# EAGLE design emonDCduo-ESP v0.4 (EAGLE 7.7.0)
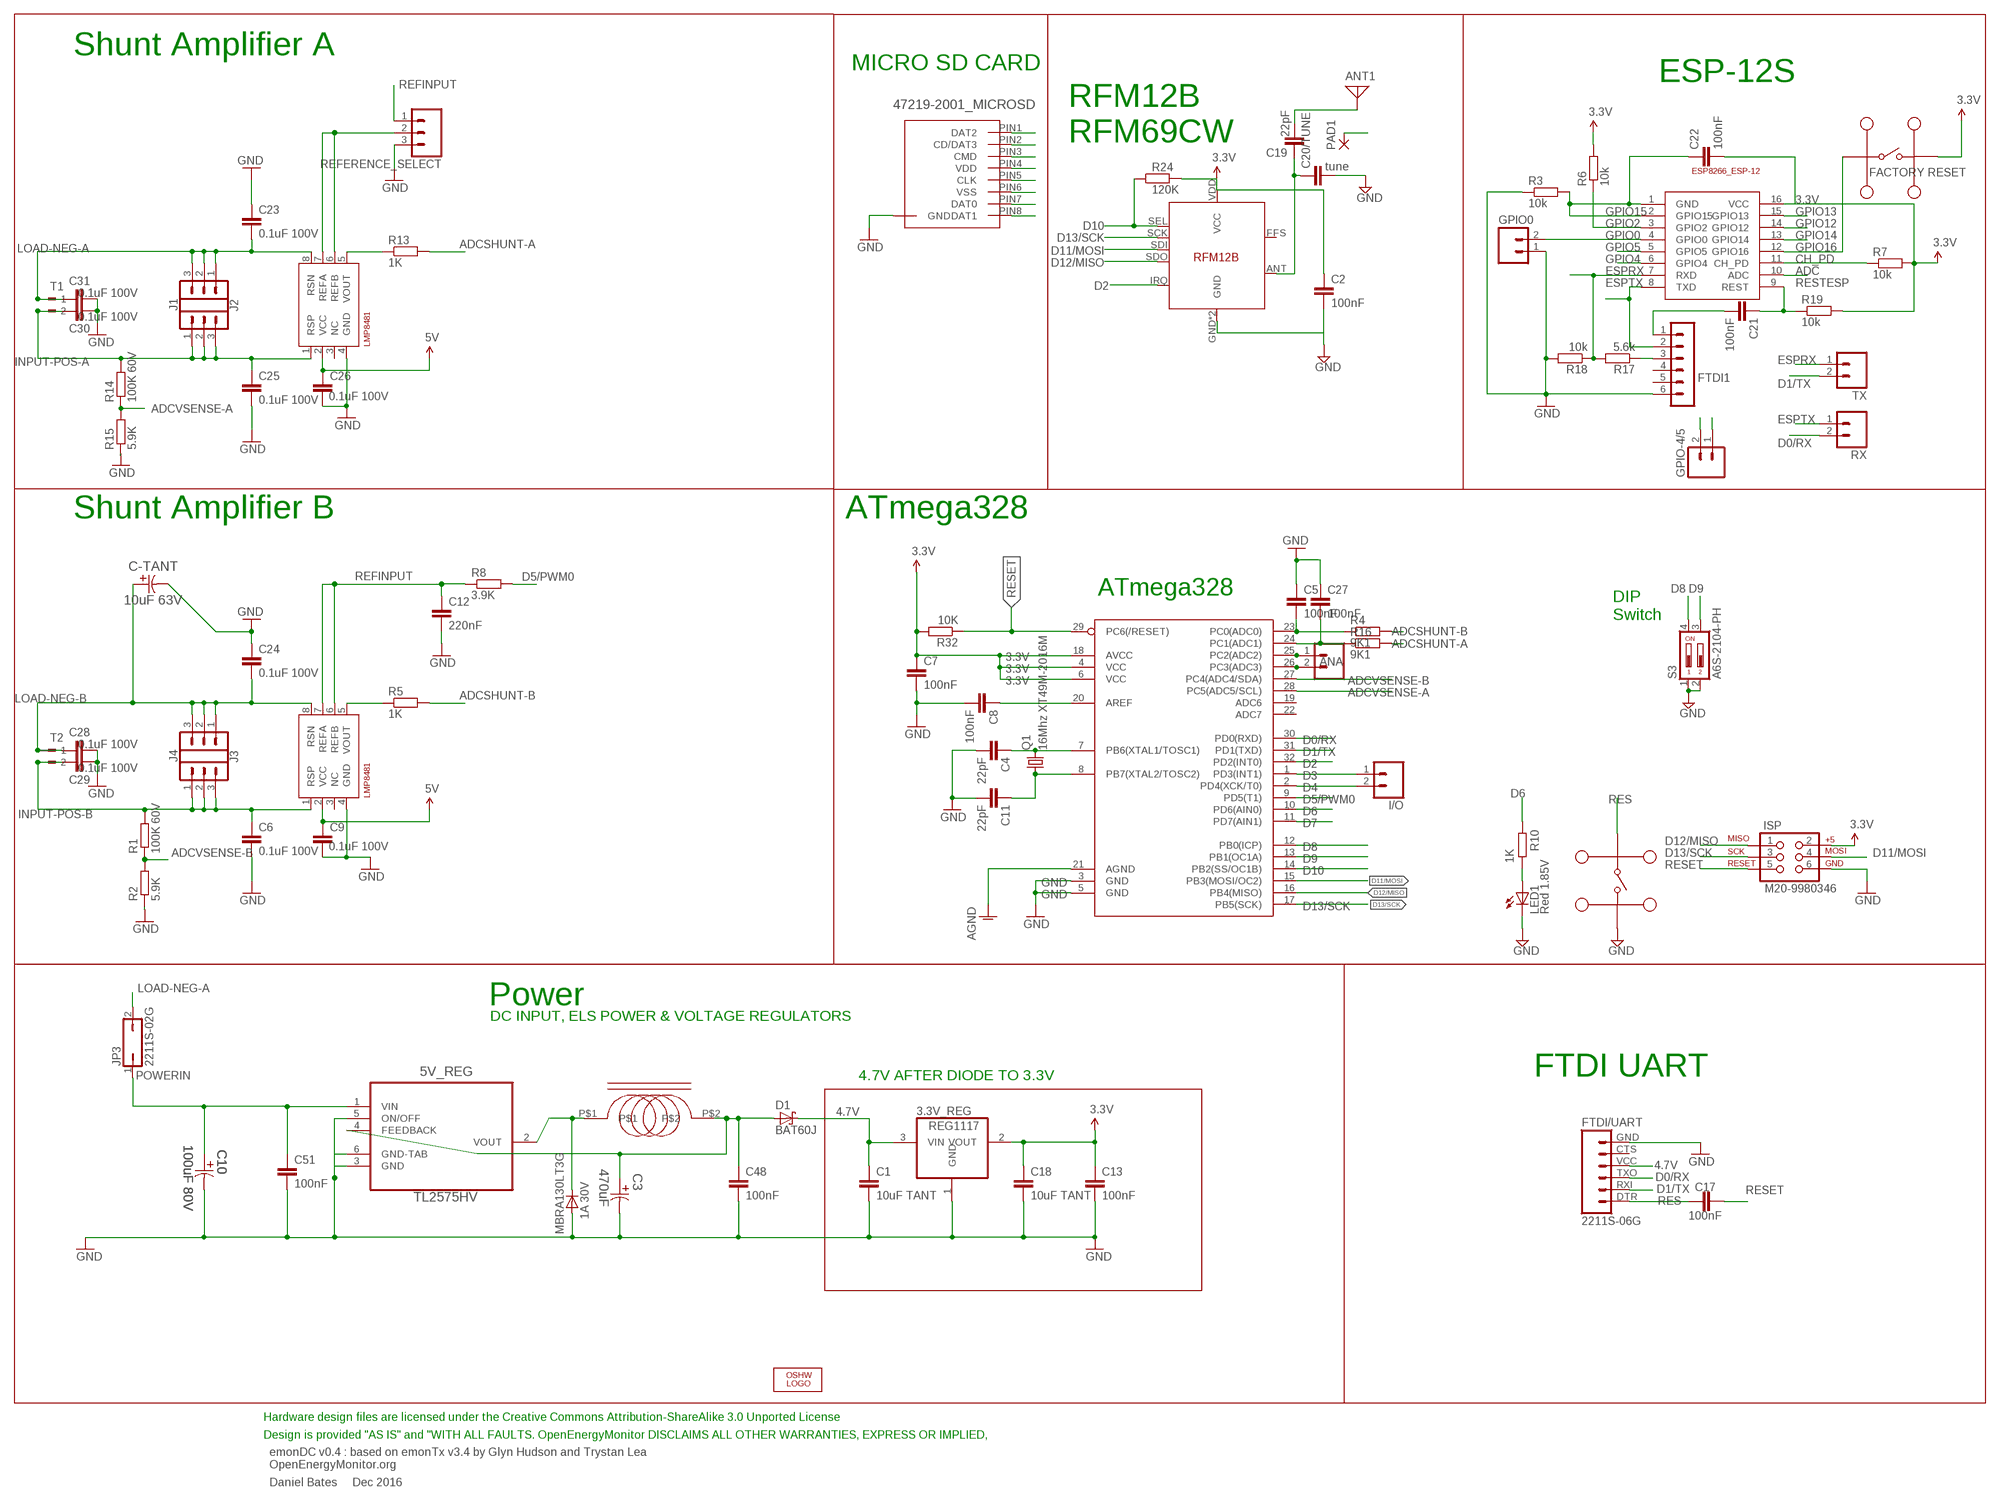
[diagram p0: schematic, sheet 1]

## Parts
3.3V_REG  REG1117  [SOT223]
5V_REG  TL2575HV  TL2575HV-05IKTTR  [TO-263]
ANA  2212S-02SG-85  M02LOCK  [1X02_LOCK]
ANT1  ANTENNA  [PAD-01]
C1  10uF TANT  C-EUC0603  [C0603]
C2  100nF  C-EUC0603  [C0603]
C3  470uF  EEE-FK1C471P-CASE-F  [CAPAE830X1050N]
C4  22pF  C-EUC0603  [C0603]
C5  100nF  C-EUC0603  [C0603]
C6  0.1uF 100V  C-EUC0603  [C0603]
C7  100nF  C-EUC0603  [C0603]
C8  100nF  C-EUC0603  [C0603]
C9  0.1uF 100V  C-EUC0603  [C0603]
C10  100uF 80V  EEV-FK1K101Q-CASE-H13  [CAPAE1350X1400N]
C11  22pF  C-EUC0603  [C0603]
C12  220nF  C-EUC0603  [C0603]
C13  100nF  C-EUC0603  [C0603]
C17  100nF  C-EUC0603  [C0603]
C18  10uF TANT  C-EUC0603  [C0603]
C19  22pF  C-EUC0603  [C0603]
C20/TUNE  tune  C-EUC0603  [C0603]
C21  100nF  C-EUC0603  [C0603]
C22  100nF  C-EUC0603  [C0603]
C23  0.1uF 100V  C-EUC0603  [C0603]
C24  0.1uF 100V  C-EUC0603  [C0603]
C25  0.1uF 100V  C-EUC0603  [C0603]
C26  0.1uF 100V  C-EUC0603  [C0603]
C27  100nF  C-EUC0603  [C0603]
C28  0.1uF 100V  C-EUC0603  [C0603]
C29  0.1uF 100V  C-EUC0603  [C0603]
C30  0.1uF 100V  C-EUC0603  [C0603]
C31  0.1uF 100V  C-EUC0603  [C0603]
C48  100nF  C-EUC0603  [C0603]
C51  100nF  C-EUC0603  [C0603]
C-TANT  10uF 63V  293D  [2917]
D1  BAT60J  [SOD323_ST]
D2  MBRA130LT3G  [DO-214]
ESP-12  ESP8266_ESP-12  [ESP8266-ESP12]
FTDI1  FTDI-ESP  MA06-1  [MA06-1]
FTDI/UART  2211S-06G  FTDI_BASICPTH  [FTDI_BASIC]
GPIO0  M02PTH  [1X02]
GPIO-4/5  M02PTH  [1X02]
I1  SRR0603-331KL  [SRR0603-331KL]
I/O  2212S-02SG-85  M02LOCK  [1X02_LOCK]
ISP  M20-9980346  AVR_SPI_PRG_6PTH  [2X3]
J1  CONN_03  [1X03]
J2  CONN_03  [1X03]
J3  CONN_03  [1X03]
J4  CONN_03  [1X03]
JP3  2211S-02G  JP1Q  [JP1]
LED1  Red 1.85V  LEDCHIP-LED0805  [CHIP-LED0805]
LOGO1  OSHW_LOGO_6MILX0200-NT  [OSHW_6X200_NOTEXT]
MC1  MC32882  [SWITCH_TACT_MULTICOMP]
MC32882  MC32882  [SWITCH_TACT_MULTICOMP]
PAD1  SMD2  [SMD1,27-2,54]
Q1  16Mhz XT49M-2016M  CRYSTALHC49UP  [HC49UP]
R1  100K 60V  R-EU_R0603  [R0603]
R2  5.9K  R-EU_R0603  [R0603]
R3  10k  R-EU_R0603  [R0603]
R4  9K1  R-EU_R0603  [R0603]
R5  1K  R-EU_R0603  [R0603]
R6  10k  R-EU_R0603  [R0603]
R7  10k  R-EU_R0603  [R0603]
R8  3.9K  R-EU_R0603  [R0603]
R10  1K  R-EU_R0603  [R0603]
R13  1K  R-EU_R0603  [R0603]
R14  100K 60V  R-EU_R0603  [R0603]
R15  5.9K  R-EU_R0603  [R0603]
R16  9K1  R-EU_R0603  [R0603]
R17  5.6k  R-EU_R0603  [R0603]
R18  10k  R-EU_R0603  [R0603]
R19  10k  R-EU_R0603  [R0603]
R24  120K  R-EU_R0603  [R0603]
R32  10K  R-EU_R0603  [R0603]
REFERENCE_SELECT  2212S-02SG-85  CONN_03  [1X03]
RF  RFM12B  [RFM12B]
RX  M02PTH  [1X02]
S3  A6S-2104-PH  2_SMT_DIP_SWITCH  [DIP_SWITCH_SMT]
SHUNTMON-A  LMP8481  LMP8481LMP8481-H  [S-PDSO-G08]
SHUNTMON-B  LMP8481  LMP8481LMP8481-H  [S-PDSO-G08]
T1  180-2  [180-2]
T2  180-2  [180-2]
TX  M02PTH  [1X02]
U1_TQFP  ATMEGA328P  ATMEGA328_SMT  [TQFP32-08]
U$1  47219-2001_MICROSD  [47219-2001_MICROSD]

## Nets
3.3V: 3.3V_REG.2(VOUT) C2.1 C7.1 C13.1 C18.1 C22.2 ESP-12.16(VCC) ISP.2 MC1.P$3 MC1.P$4 R6.2 R7.2 R19.2 R24.2 R32.2 RF.VDD(VCC) U1_TQFP.4(VCC) U1_TQFP.6(VCC) U1_TQFP.18(AVCC) U$1.PIN4(VDD)
4.7V [power]: 3.3V_REG.3(VIN) C1.1 C9.1 C26.1 D1.C FTDI/UART.VCC SHUNTMON-A.2(VCC) SHUNTMON-B.2(VCC) ; supply symbol labelled 5V
5.0V [power]: 5V_REG.4(FEEDBACK) C3.1 C48.1 D1.A I1.P$2
ADC: ESP-12.10(ADC)
ADC2: ANA.1 U1_TQFP.25(PC2(ADC2))
ADC3: ANA.2 U1_TQFP.26(PC3(ADC3))
ADCSHUNT-A: R13.2 R16.2
ADCSHUNT-B: R4.2 R5.2
ADCVSENSE-A: R14.1 R15.2 U1_TQFP.28(PC5(ADC5/SCL))
ADCVSENSE-B: R1.1 R2.2 U1_TQFP.27(PC4(ADC4/SDA))
AGND [thin_power]: U1_TQFP.21(AGND)
CH_PD: ESP-12.11(CH_PD) R7.1
D0/RX: FTDI/UART.TXO RX.2 U1_TQFP.30(PD0(RXD))
D1/TX: FTDI/UART.RXI TX.2 U1_TQFP.31(PD1(TXD))
D2: RF.IRQ U1_TQFP.32(PD2(INT0))
D3: I/O.1 U1_TQFP.1(PD3(INT1))
D4: I/O.2 U1_TQFP.2(PD4(XCK/T0))
D5/PWM0: R8.2 U1_TQFP.9(PD5(T1))
D6: R10.2 U1_TQFP.10(PD6(AIN0))
D7: U1_TQFP.11(PD7(AIN1))
D8: S3.4 U1_TQFP.12(PB0(ICP))
D9: S3.3 U1_TQFP.13(PB1(OC1A))
D10: R24.1 RF.SEL U1_TQFP.14(PB2(SS/OC1B))
D11/MOSI: ISP.4 RF.SDI U1_TQFP.15(PB3(MOSI/OC2))
D12/MISO: ISP.1 RF.SDO U1_TQFP.16(PB4(MISO))
D13/SCK: ISP.3 RF.SCK U1_TQFP.17(PB5(SCK))
DIG1: C19.1 C20/TUNE.1 RF.ANT
ESPRX: ESP-12.7(RXD) R17.2 R18.1 TX.1
ESPTX: ESP-12.8(TXD) FTDI1.2 RX.1
GND [thin_power]: 3.3V_REG.1(GND) 5V_REG.3(GND) 5V_REG.5(ON/OFF) 5V_REG.6(GND-TAB) C1.2 C2.2 C3.2 C4.2 C5.1 C6.2 C7.2 C8.2 C9.2 C10.2 C11.2 C12.2 C13.2 C18.2 C20/TUNE.2 C23.1 C24.1 C25.2 C26.2 C27.1 C28.2 C29.2 C30.2 C31.2 C48.2 C51.2 C-TANT.2 D2.P$2(A) FTDI1.6 FTDI/UART.GND GPIO0.1 ISP.6 LED1.C MC32882.P$3 MC32882.P$4 R2.1 R3.1 R15.1 R18.2 REFERENCE_SELECT.3 RF.GND RF.P$12(GND) S3.1 S3.2 SHUNTMON-A.4(GND) SHUNTMON-B.4(GND) U1_TQFP.3(GND) U1_TQFP.5(GND) U$1.P$1(GND) U$1.P$2(GND) U$1.P$3(GND) U$1.P$4(GND) U$1.PIN6(VSS)
GPIO0: ESP-12.4(GPIO0) GPIO0.2
GPIO2: ESP-12.3(GPIO2) R6.1 U$1.PIN2(CD/DAT3)
GPIO4: ESP-12.6(GPIO4) GPIO-4/5.1
GPIO5: ESP-12.5(GPIO5) GPIO-4/5.2
GPIO12: ESP-12.14(GPIO12) U$1.PIN7(DAT0)
GPIO13: ESP-12.15(GPIO13) U$1.PIN3(CMD)
GPIO14: ESP-12.13(GPIO14) U$1.PIN5(CLK)
GPIO15: C22.1 ESP-12.1(GND) ESP-12.2(GPIO15) R3.2
GPIO16: ESP-12.12(GPIO16) MC1.P$1 MC1.P$2
IND: 5V_REG.2(VOUT) D2.P$1(C) I1.P$1
INPUT-POS-A: C25.1 C30.1 J2.1 J2.2 J2.3 R14.2 SHUNTMON-A.1(RSP) T1.2
INPUT-POS-B: C6.1 C29.1 J3.1 J3.2 J3.3 R1.2 SHUNTMON-B.1(RSP) T2.2
LOAD-NEG-A: C23.2 C31.1 J1.1 J1.2 J1.3 JP3.2 SHUNTMON-A.8(RSN) T1.1
LOAD-NEG-B: C24.2 C28.1 C-TANT.1 J4.1 J4.2 J4.3 SHUNTMON-B.8(RSN) T2.1
N$1: C4.1 Q1.2 U1_TQFP.7(PB6(XTAL1/TOSC1))
N$2: C5.2 R4.1 U1_TQFP.23(PC0(ADC0))
N$3: ANT1.1 C19.2
N$4: R13.1 SHUNTMON-A.5(VOUT)
N$5: PAD1.1(P)
N$6: R5.1 SHUNTMON-B.5(VOUT)
N$7: U$1.PIN1(DAT2)
N$9: C11.1 Q1.1 U1_TQFP.8(PB7(XTAL2/TOSC2))
N$20: C8.1 U1_TQFP.20(AREF)
N$27: C27.2 R16.1 U1_TQFP.24(PC1(ADC1))
N$28 [thin_power]: REFERENCE_SELECT.2 SHUNTMON-A.6(REFB) SHUNTMON-A.7(REFA)
N$30: C21.2 FTDI1.1
N$32: U$1.PIN8(DAT1)
N$36: FTDI1.3 R17.1
N$41: LED1.A R10.1
POWERIN: 5V_REG.1(VIN) C10.1 C51.1 JP3.1
REFINPUT: C12.1 R8.1 REFERENCE_SELECT.1 SHUNTMON-B.6(REFB) SHUNTMON-B.7(REFA)
RES: C17.1 FTDI/UART.DTR MC32882.P$1 MC32882.P$2
RESET: C17.2 ISP.5 R32.1 U1_TQFP.29(PC6(/RESET))
RESTESP: C21.1 ESP-12.9(REST) R19.1
Unconnected: FTDI1.4 FTDI1.5 FTDI/UART.CTS RF.FFS SHUNTMON-A.3(NC) SHUNTMON-B.3(NC) U1_TQFP.19(ADC6) U1_TQFP.22(ADC7)

## Notes on the sheet
- Shunt Amplifier A
- MICRO SD CARD
- ESP-12S
- RFM12B
  RFM69CW
- FACTORY RESET
- Shunt Amplifier B | ATmega328
- ATmega328
- DIP
  Switch
- Power
- DC INPUT, ELS POWER & VOLTAGE REGULATORS
- 4.7V AFTER DIODE TO 3.3V | FTDI UART
- Hardware design files are licensed under the Creative Commons Attribution-ShareAlike 3.0 Unported License
- Design is provided "AS IS" and "WITH ALL FAULTS. OpenEnergyMonitor DISCLAIMS ALL OTHER WARRANTIES, EXPRESS OR IMPLIED,
- emonDC v0.4 : based on emonTx v3.4 by Glyn Hudson and Trystan Lea
  OpenEnergyMonitor.org
- Daniel Bates     Dec 2016

## Library data of the parts
3.3V_REG = burr-brown:REG1117: 800mA and 1A Low Dropout (LDO) Positive Regulator 1.8V, 2.5V, 2.85V, 3.3V, 5V, and Adj; MF: TEXAS INSTRUMENTS; MPN: REG1117; OC_FARNELL: 1097566; OC_NEWARK: 14P6981
5V_REG = TL2575HV:TL2575HV; MF: TEXAS INSTRUMENTS; MPN: LM2575HVS-15/NOPB; OC_FARNELL: 2492609
ANA I/O = SparkFun-Connectors:M02: Standard 2-pin 0.1" header. Use with - straight break away headers ( PRT-00116) - right angle break away headers (PRT-00553) - swiss pins (PRT-00743) - machine pins (PRT-00117) - female headers (PRT-00115) Molex polarized connector foot print use with: PRT-08233 with associated crimp pins and housings. 2.54_SCREWTERM for use with PRT-10571. 3.5mm Screw Terminal footprints for PRT-08084 5mm Screw Terminal footprints for use with PRT-08432; MF: MULTICOMP; MPN: 2212S-02SG-85; OC_FARNELL: 1593458
ANT1 = discrete:ANTENNA: Antenna; OC_FARNELL: unknown
C1 C2 C4 C5 C7 C8 C11-C13 C17-C19 C20/TUNE C21 C22 C27 C48 C51 = rcl:C-EU: CAPACITOR, European symbol
C3 = Panasonic-EEEFK_EEEFP:EEE-: Aluminum Electrolytic Capacitors,Surface Mount Type; MPN: EEE-FK1C471P; OC_FARNELL: 9695710; OC_NEWARK: 96K9385; PACKAGE: CASE-F; SUPPLIER: PANASONIC; TOLERANCE: ±20 %; VALUE: 470UF; VOLTAGERATING: 16V
C6 C9 C23-C26 C28-C31 = rcl:C-EU: CAPACITOR, European symbol; MPN: C1608X7S2A104K080AB
C10 = Panasonic-EEE-EEV-EEF-ECQ:EEV-: Aluminum Electrolytic Capacitors,Surface Mount Type; MPN: EEVFK1K101Q; OC_FARNELL: 9696113; OC_NEWARK: 96K9484; SUPPLIER: PANASONIC; TOLERANCE: ±20 %; VALUE: 100UF; VOLTAGERATING: 80V
C-TANT = 2917 footprint capacitor:293D; PARTNO: 293D106X0063E2TE3; SIZE: 2917
D1 = diode:BAT60J: Schottky barrier diode Source: www.st.com, BAT60J.pdf
D2 = CASE 403D Diode:MBRA130LT3G: Fast switching diode; MF: ON SEMICONDUCTOR; MPN: MBRA130LT3G; OC_FARNELL: 9555978
ESP-12 = ESP8266-ESP12:ESP8266_ESP-12
FTDI1 = JeeLabs:MA06-1: PIN HEADER
FTDI/UART = SparkFun:FTDI_BASIC: FTDI Basic: 3.3V and 5V; MF: MULTICOMP; MPN: 2211S-06G; OC_FARNELL: 1593415
GPIO0 GPIO-4/5 RX TX = SparkFun:M02: Header 2 Standard 2-pin 0.1" header. Use with straight break away headers (SKU : PRT-00116), right angle break away headers (PRT-00553), swiss pins (PRT-00743), machine pins (PRT-00117), and female headers (PRT-00115). Molex polarized connector foot print use with SKU : PRT-08233 with associated crimp pins and housings.
I1 = SRR0603-331KL:SRR0603-331KL: SRR0603-331KL; INDUCTANCE: 330uH; MF: BOURNS; MPN: SRR0603-331KL; OC_FARNELL: 2333890
ISP = SparkFun:AVR_SPI_PRG_6: AVR ISP 6 Pin This is the reduced ISP connector for AVR programming. Common on Arduino. This footprint will take up less PCB space and can be used with a 10-pin to 6-pin adapter such as SKU: BOB-08508; MF: HARWIN; MPN: M20-9980346; OC_FARNELL: 1022231
J1-J4 = SparkFun-Connectors:CONN_03: Multi connection point. Often used as Generic Header-pin footprint for 0.1 inch spaced/style header connections On any of the 0.1 inch spaced packages, you can populate with these: Break Away Headers - Straight <https://www.sparkfun.com/products/116> (PRT-00116) Break Away Male Headers - Right Angle <https://www.sparkfun.com/products/553> (PRT-00553) Female Headers <https://www.sparkfun.com/products/115> (PRT-00115) Break Away Headers - Machine Pin <https://www.sparkfun.com/products/117> (PRT-00117) Break Away Female Headers - Swiss Machine Pin <https://www.sparkfun.com/products/743> (PRT-00743) Stackable Header - 3 Pin (Female, 0.1") <https://www.sparkfun.com/products/13875> (PRT-13875) For SCREWTERMINALS and SPRING TERMINALS visit here: Screw Terimnals on SparkFun.com <https://www.sparkfun.com/search/results?term=Screw+Terminals> (5mm/3.5mm/2.54mm spacing) This device is also useful as a general connection point to wire up your design to another part of your project. Our various solder wires solder well into these plated through hole pads. Hook-Up Wire - Assortment (Stranded, 22 AWG) <https://www.sparkfun.com/products/11375> (PRT-11375) Hook-Up Wire - Assortment (Solid Core, 22 AWG) <https://www.sparkfun.com/products/11367> (PRT-11367) View the entire wire category on our website here <https://www.sparkfun.com/categories/141> Special notes: Molex polarized connector foot print use with SKU : PRT-08232 with associated crimp pins and housings.
JP3 = jumper:JP1Q: JUMPER; MF: MULTICOMP; MPN: 2211S-02G; OC_FARNELL: 1593411
LED1 = adafruit:LED: LED OSRAM: - CHIPLED LG R971, LG N971, LY N971, LG Q971, LY Q971, LO R971, LY R971 LH N974, LH R974 LS Q976, LO Q976, LY Q976 LO Q996 - Hyper CHIPLED LW Q18S LB Q993, LB Q99A, LB R99A - SideLED LS A670, LO A670, LY A670, LG A670, LP A670 LB A673, LV A673, LT A673, LW A673 LH A674 LY A675 LS A676, LA A676, LO A676, LY A676, LW A676 LS A679, LY A679, LG A679 - Hyper Micro SIDELED® LS Y876, LA Y876, LO Y876, LY Y876 LT Y87S - SmartLED LW L88C, LW L88S LB L89C, LB L89S, LG L890 LS L89K, LO L89K, LY L89K LS L896, LA L896, LO L896, LY L896 - TOPLED LS T670, LO T670, LY T670, LG T670, LP T670 LSG T670, LSP T670, LSY T670, LOP T670, LYG T670 LG T671, LOG T671, LSG T671 LB T673, LV T673, LT T673, LW T673 LH T674 LS T676, LA T676, LO T676, LY T676, LB T676, LH T676, LSB T676, LW T676 LB T67C, LV T67C, LT T67C, LS T67K, LO T67K, LY T67K, LW E67C LS E67B, LA E67B, LO E67B, LY E67B, LB E67C, LV E67C, LT E67C LW T67C LS T679, LY T679, LG T679 LS T770, LO T770, LY T770, LG T770, LP T770 LB T773, LV T773, LT T773, LW T773 LH T774 LS E675, LA E675, LY E675, LS T675 LS T776, LA T776, LO T776, LY T776, LB T776 LHGB T686 LT T68C, LB T68C - Hyper Mini TOPLED® LB M676 - Mini TOPLED Santana® LG M470 LS M47K, LO M47K, LY M47K Source: http://www.osram.convergy.de/; MF: ROHM; MPN: SML-211UTT86K; OC_FARNELL: 1685056
LOGO1 = ohw-logo:OSHW_LOGO_6MIL; OC_FARNELL: unknown
MC1 MC32882 = multicomp tact switch:MC32882
PAD1 = wirepad:SMD2: SMD PAD
Q1 = adafruit:CRYSTAL: CRYSTAL; MF: VISHAY; MPN: XT49M-2016M; OC_FARNELL: 1469641; OC_NEWARK: unknown
R1 R14 = rcl:R-EU_: RESISTOR, European symbol; MPN: MCWR06X1003FTL
R2 R15 = rcl:R-EU_: RESISTOR, European symbol; MPN: MCWR06X5901FTL
R3-R8 R10 R13 R16-R19 R24 R32 = rcl:R-EU_: RESISTOR, European symbol
REFERENCE_SELECT = SparkFun-Connectors:CONN_03: Multi connection point. Often used as Generic Header-pin footprint for 0.1 inch spaced/style header connections On any of the 0.1 inch spaced packages, you can populate with these: Break Away Headers - Straight <https://www.sparkfun.com/products/116> (PRT-00116) Break Away Male Headers - Right Angle <https://www.sparkfun.com/products/553> (PRT-00553) Female Headers <https://www.sparkfun.com/products/115> (PRT-00115) Break Away Headers - Machine Pin <https://www.sparkfun.com/products/117> (PRT-00117) Break Away Female Headers - Swiss Machine Pin <https://www.sparkfun.com/products/743> (PRT-00743) Stackable Header - 3 Pin (Female, 0.1") <https://www.sparkfun.com/products/13875> (PRT-13875) For SCREWTERMINALS and SPRING TERMINALS visit here: Screw Terimnals on SparkFun.com <https://www.sparkfun.com/search/results?term=Screw+Terminals> (5mm/3.5mm/2.54mm spacing) This device is also useful as a general connection point to wire up your design to another part of your project. Our various solder wires solder well into these plated through hole pads. Hook-Up Wire - Assortment (Stranded, 22 AWG) <https://www.sparkfun.com/products/11375> (PRT-11375) Hook-Up Wire - Assortment (Solid Core, 22 AWG) <https://www.sparkfun.com/products/11367> (PRT-11367) View the entire wire category on our website here <https://www.sparkfun.com/categories/141> Special notes: Molex polarized connector foot print use with SKU : PRT-08232 with associated crimp pins and housings.; MF: MULTICOMP; MPN: 2212S-02SG-85; OC_FARNELL: 1593458
RF = JeeParts:RFM12B; OC_FARNELL: unknown
S3 = OpenEnergyMonitor:2_SMT_DIP_SWITCH: Multicomp MCEMR-02-T 2 throw SMT DIP switch, Farnell 1524005; MF: OMRON ELECTRONIC COMPONENTS; MPN: A6S2104H; OC_FARNELL: 1960894
SHUNTMON-A = lmp8481b:LMP8481: LMP8481MM-H/NOPB 100V/V; MF: TEXAS INSTRUMENTS; MPN: LMP8481MME-S/NOPB; OC_FARNELL: 2322044
SHUNTMON-B = lmp8481b:LMP8481: LMP8481MM-H/NOPB 100V/V; MF: TEXAS INSTRUMENTS; MPN: LMP8481MME-H/NOPB; OC_FARNELL: 2322044
T1 T2 = con-weidmueller-sl35:180-2: WEIDMUELLER CLAMP CONNECTOR; OC_FARNELL: unknown; OC_NEWARK: unknown
U1_TQFP = SparkFun-DigitalIC:ATMEGA328_SMT: 32-Pin Atmega328 part Commonly used on Arduino compatible boards Available in QFP and QFN packages TQFP is IC-09069 QFN is non-stock; MF: ATMEL; MPN: ATMEGA328P-AU; OC_FARNELL: 1972086; PROD_ID: IC-09069
U$1 = 47219-2001_SD_MICRO:47219-2001_MICROSD

## Net classes
2 thin_power: width 0.254 mm

## Board
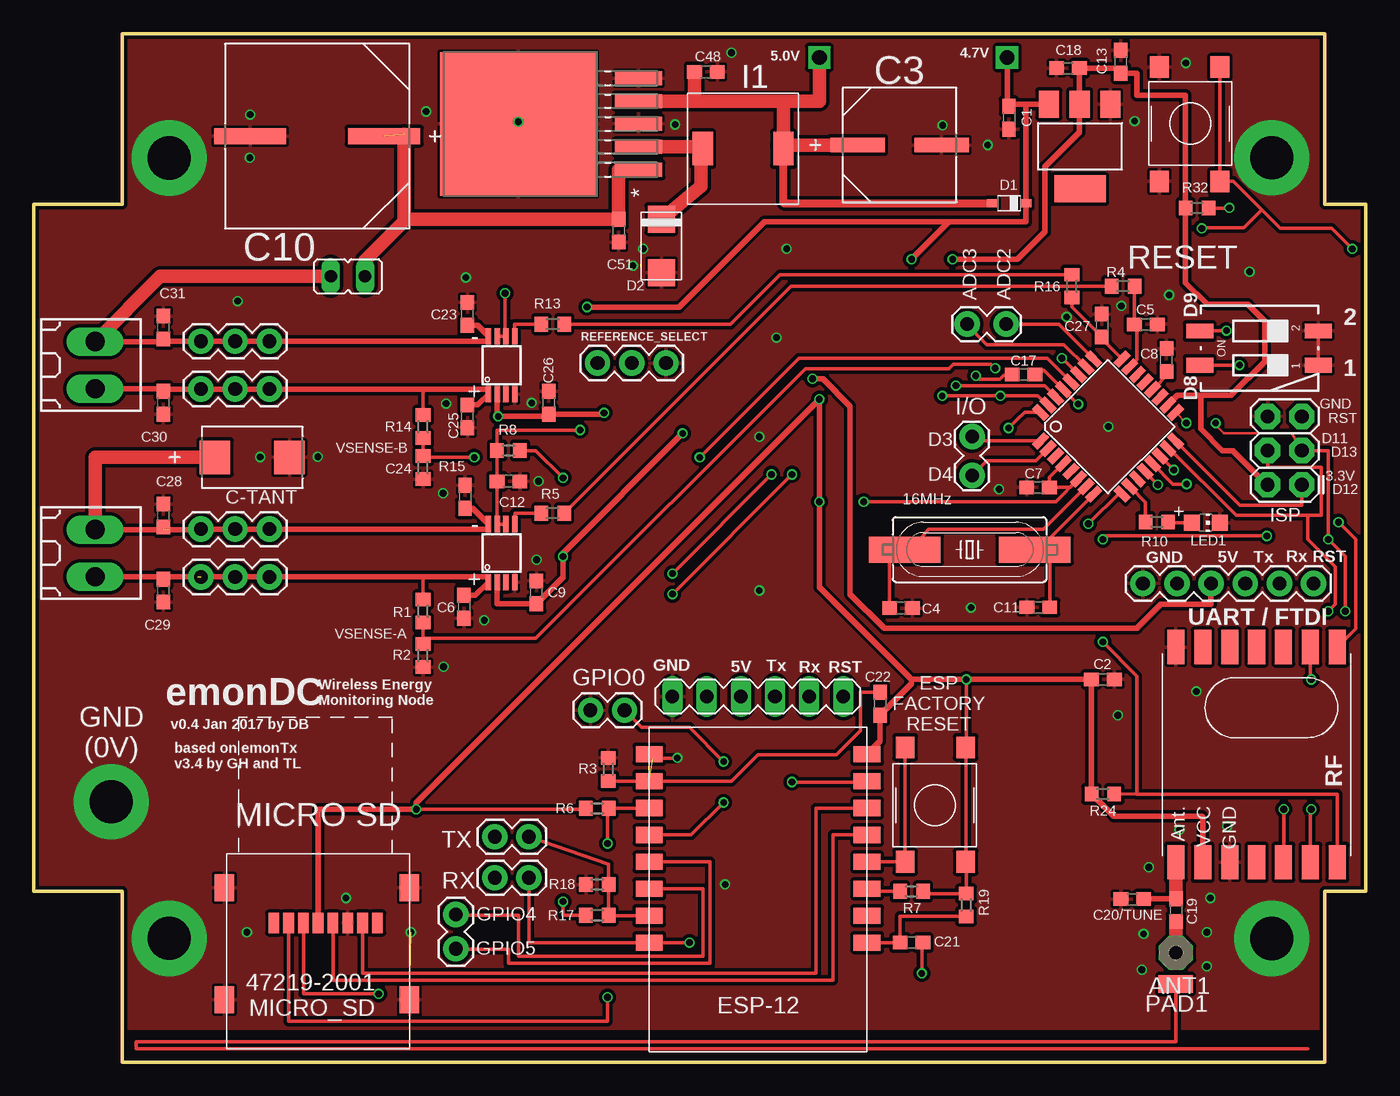
[diagram p1: board, top side]
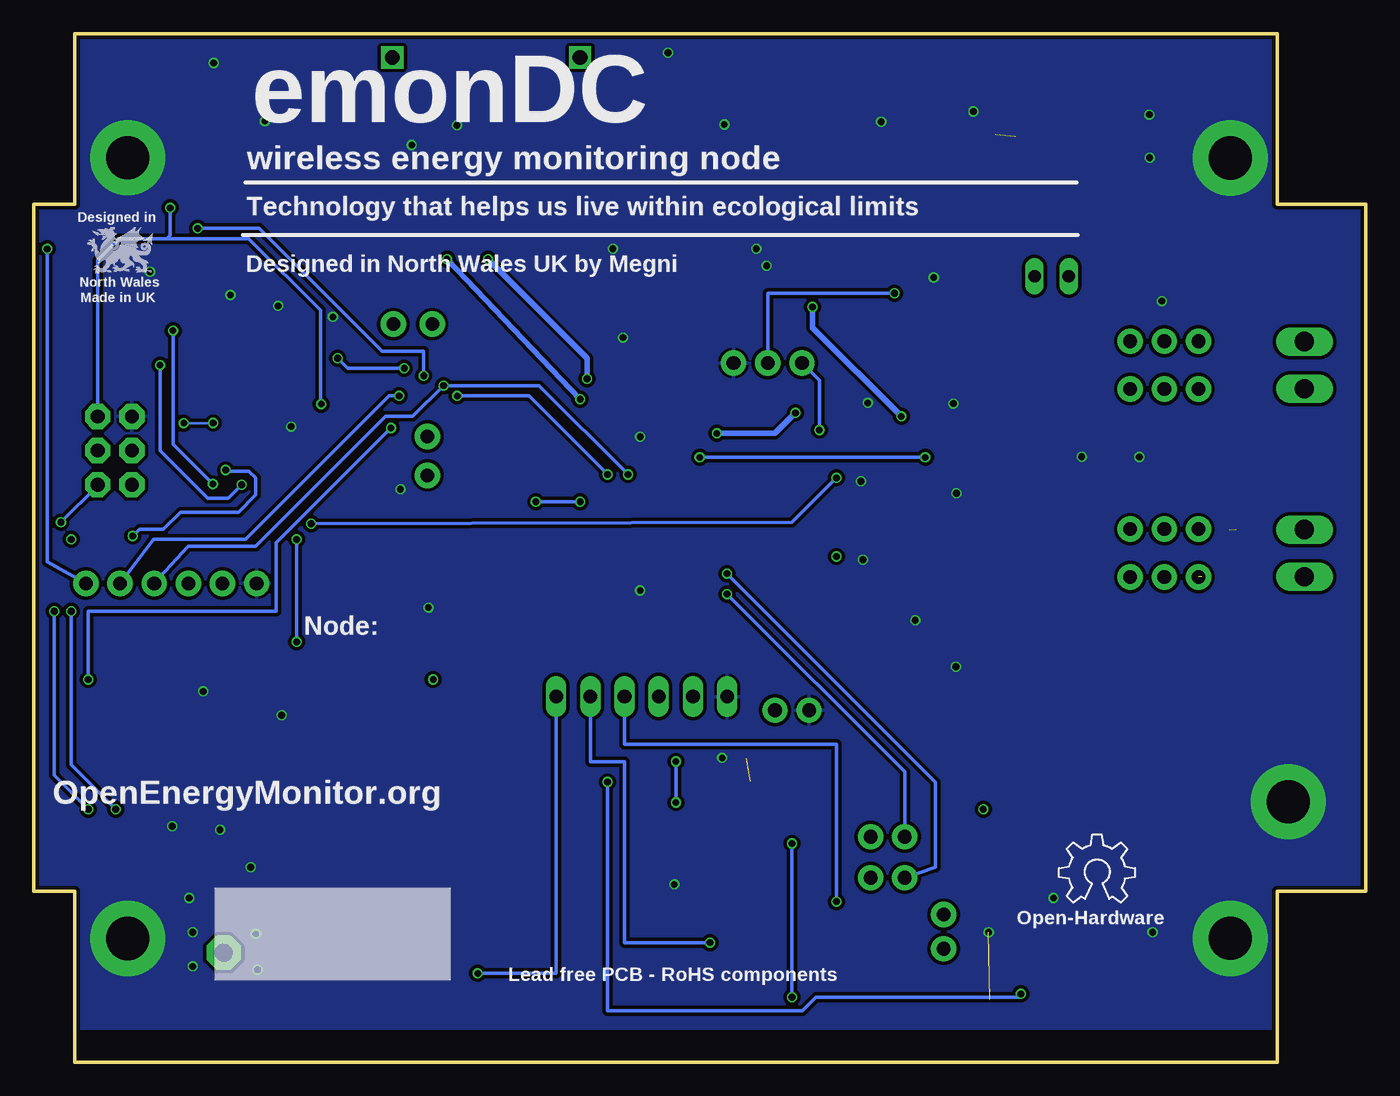
[diagram p2: board, bottom side, seen from below]

Size 99.06 x 76.45 mm. Coordinates in mm from the lower left corner, seen from the top.
Outline: 6.6,63.75 6.6,76.45 96.01,76.45 96.01,63.75 99.06,63.75 99.06,12.7 96.01,12.7 96.01,0 6.6,0 6.6,12.7 0,12.7 0,63.75 6.6,63.75
Copper layers (1*16): Top 0.018mm / dielectric 1.55mm / Bottom 0.018mm
Design rules "Multi-CB_2L_125um-Tracks_OL35um": minimum track width 0.125mm, minimum drill 0.2mm, track to track 0.125mm, track to pad 0.125mm, pad to pad 0.125mm, via to via 0.125mm, smd to smd 0mil, copper to edge 0.2mm, drill to drill 0.2mm, minimum pad ring 0.125mm, minimum via ring 0.125mm, stop-mask expansion 2mil, vias tented up to drill 0.45mm, thermal gap 0.2mm

### Footprints (pad centres in the part's own frame; a part is rotated, then mirrored left to right if it is on the bottom)
SOT223 = smd 1.499 x 2.007: 1 -2.261,-3.15; 2 0.025,-3.15; 3 2.311,-3.15 | smd 3.81 x 2.007: 4 0,3.15
TO-263 = smd 1.041 x 3.505: 1 -3.404,-8.788; 2 -1.702,-8.788; 3 0,-8.788; 4 1.702,-8.788; 5 3.404,-8.788 | smd 10.668 x 11.659: 6 0,0.152
1X02_LOCK = drill 1.016 pad 1.88: 1 -0.178,0; 2 2.718,0
PAD-01 = drill 1.321 pad 2.54 octagon: 1 0,0
C0603 = smd 1.1 x 1: 1 -0.85,0; 2 0.85,0
CAPAE830X1050N = smd 4.064 x 1.092: 1 -3.124,0; 2 3.124,0
CAPAE1350X1400N = smd 5.359 x 1.194: 1 -4.978,0; 2 4.978,0
2917 = smd 2.261 x 2.489: 1 -2.769,0; 2 2.769,0
SOD323_ST = smd 0.8 x 0.6: A 1.25,0; C -1.25,0
DO-214 = smd 2 x 2: P$1 -2,0; P$2 2,0
ESP8266-ESP12 = smd 2 x 1.2: 1 16.2,2; 2 16.2,4; 3 16.2,6; 4 16.2,8; 5 16.2,10; 6 16.2,12; 7 16.2,14; 8 16.2,16; 9 0,16; 10 0,14; 11 0,12; 12 0,10; 13 0,8; 14 0,6; 15 0,4; 16 0,2
MA06-1 = drill 1.016 long: 1 0,0; 2 2.54,0; 3 5.08,0; 4 7.62,0; 5 10.16,0; 6 12.7,0
FTDI_BASIC = drill 1.016 pad 1.88: CTS 10.16,0; DTR 0,0; GND 12.7,0; RXI 2.54,0; TXO 5.08,0; VCC 7.62,0
1X02 = drill 1.016 pad 1.88: 1 0,0; 2 2.54,0
SRR0603-331KL = smd 1.5 x 2.5: P$1 -3,0; P$2 3,0
2X3 = drill 1.016 pad 1.88 octagon: 1 0,0; 2 0,2.54; 3 2.54,0; 4 2.54,2.54; 5 5.08,0; 6 5.08,2.54
1X03 = drill 1.016 pad 1.88: 1 0,0; 2 2.54,0; 3 5.08,0
JP1 = drill 0.914 long: 1 0,-1.27; 2 0,1.27
CHIP-LED0805 = smd 1.2 x 1.2: A 0,-1.05; C 0,1.05
SWITCH_TACT_MULTICOMP = smd 1.6 x 1.4: P$1 -1.1,5.3; P$2 7.4,5.3; P$3 -1.1,0.8; P$4 7.4,0.8
SMD1,27-2,54 = smd 1.27 x 2.54: 1 0,0
HC49UP = smd 5.334 x 1.93: 1 -4.826,0; 2 4.826,0
R0603 = smd 1 x 1.1: 1 -0.85,0; 2 0.85,0
RFM12B = smd 2.54 x 1.27: ANT 8,-6; FFS -8,2; GND 8,-2; IRQ -8,4; P$8 -8,0; P$9 -8,-2; P$10 -8,-4; P$12 -8,-6; P$16 8,0; SCK 8,4; SDI 8,2; SDO -8,6; SEL 8,6; VDD 8,-4
DIP_SWITCH_SMT = smd 1.1 x 2: 1 -1.27,-4.215; 2 1.27,-4.215; 3 1.27,4.615; 4 -1.27,4.615
S-PDSO-G08 = smd 0.4 x 1.2: 1 -0.975,-2.157; 2 -0.325,-2.157; 3 0.325,-2.157; 4 0.975,-2.157; 5 0.975,2.157; 6 0.325,2.157; 7 -0.325,2.157; 8 -0.975,2.157
180-2 = drill 1.422 long: 1 -1.75,0; 2 1.75,0
TQFP32-08 = smd 1.27 x 0.559: 1 -4.293,2.8; 2 -4.293,2; 3 -4.293,1.2; 4 -4.293,0.4; 5 -4.293,-0.4; 6 -4.293,-1.2; 7 -4.293,-2; 8 -4.293,-2.8; 17 4.293,-2.8; 18 4.293,-2; 19 4.293,-1.2; 20 4.293,-0.4; 21 4.293,0.4; 22 4.293,1.2; 23 4.293,2; 24 4.293,2.8 | smd 0.559 x 1.27: 9 -2.8,-4.293; 10 -2,-4.293; 11 -1.2,-4.293; 12 -0.4,-4.293; 13 0.4,-4.293; 14 1.2,-4.293; 15 2,-4.293; 16 2.8,-4.293; 25 2.8,4.293; 26 2,4.293; 27 1.2,4.293; 28 0.4,4.293; 29 -0.4,4.293; 30 -1.2,4.293; 31 -2,4.293; 32 -2.8,4.293
47219-2001_MICROSD = smd 1.45 x 2: P$1 0,0; P$2 13.75,0; P$3 0,8.3; P$4 13.75,8.3 | smd 0.8 x 1.5: PIN1 10.08,2.6; PIN2 8.98,2.6; PIN3 7.88,2.6; PIN4 6.78,2.6; PIN5 5.68,2.6; PIN6 4.58,2.6; PIN7 3.48,2.6; PIN8 2.38,2.6

### Placement (x,y rotation side)
3.3V_REG  77.8,68.07 180 top
5V_REG  36.19,69.74 90 top
ANA  72.14,54.86 180 top
ANT1  84.94,8.13 0 top
C1  72.52,70.21 270 top
C2  79.5,28.45 0 top
C3  64.39,68.17 0 top
C4  64.5,33.76 0 top
C5  82.7,54.84 180 top
C6  32,33.86 270 top
C7  74.69,42.73 180 top
C8  84.22,52.2 90 top
C9  37.39,34.93 90 top
C10  21.08,68.83 180 top
C11  74.7,33.82 180 top
C12  35.31,43.18 0 top
C13  80.83,74.37 90 top
C17  73.61,51.1 0 top
C18  76.91,73.89 180 top
C19  84.94,11.3 270 top
C20/TUNE  81.69,12.12 180 top
C21  65.28,8.89 0 top
C22  62.94,26.64 270 top
C23  32.26,55.63 270 top
C24  32.08,42.04 270 top
C25  32.26,48.01 270 top
C26  38.3,49.02 90 top
C27  79.43,54.76 270 top
C28  9.65,40.64 90 top
C29  9.65,35.05 270 top
C30  9.65,49.02 270 top
C31  9.65,54.61 90 top
C48  49.99,73.61 0 top
C51  43.5,61.81 270 top
C-TANT  16.26,44.96 0 top
D1  72.53,63.85 180 top
D2  46.68,60.67 270 top
ESP-12  61.98,24.89 180 top
FTDI1  60.2,27.18 180 top
FTDI/UART  95.17,35.59 180 top
GPIO0  41.4,26.16 0 top
GPIO-4/5  31.39,10.97 270 top
I1  330uH  [SRR0603-331KL]  52.76,67.91 0 top
I/O  69.78,46.33 270 top
ISP  94.3,42.93 90 top
J1  12.45,53.59 0 top
J2  12.45,50.04 0 top
J3  12.45,36.07 0 top
J4  12.45,39.62 0 top
JP3  23.37,58.42 90 top
LED1  87.16,40.11 270 top
LOGO1  22.83,11.86 0 bottom
MC1  70.1,16 90 top
MC32882  82.9,72.87 270 top
PAD1  84.91,5.82 90 top
Q1  69.6,38.1 180 top
R1  28.96,33.53 90 top
R2  28.96,30.23 90 top
R3  42.72,21.77 270 top
R4  81,57.69 180 top
R5  38.6,40.81 0 top
R6  41.91,18.87 180 top
R7  65.28,12.7 0 top
R8  35.31,45.47 0 top
R10  83.52,40.16 180 top
R13  38.61,54.86 0 top
R14  28.96,47.24 90 top
R15  28.96,44.2 90 top
R16  77.19,57.68 90 top
R17  41.91,10.92 0 top
R18  41.91,13.21 180 top
R19  69.34,11.68 90 top
R24  79.5,19.94 180 top
R32  86.5,63.49 180 top
REFERENCE_SELECT  41.94,51.97 0 top
RF  90.93,22.86 270 top
RX  36.83,13.72 180 top
S3  91.31,53.09 90 top
SHUNTMON-A  34.8,51.82 0 top
SHUNTMON-B  34.8,37.85 0 top
T1  4.57,51.82 270 top
T2  4.57,37.85 270 top
TX  36.83,16.76 180 top
U1_TQFP  79.88,47.24 45 top
U$1  27.94,12.95 180 top

### Tracks (layer width: path | path; a pad name or v marks a point on that pad's centre or on a via)
3.3V  (via drill 0.5)
  Top 0.203: 77.72,43.34 U1_TQFP.6
  Top 0.254: 85.03,49.58 85.03,49.56 | U1_TQFP.4 75.54,43.46 C7.1 77.07,42.73 U1_TQFP.6 75.99,41.66 v61.72,41.66 | R7.2 66.13,12.53 R19.2 69.34,14.9 MC1.P$3 MC1.P$4 69.34,23.44 v69.34,28.45 69.3,28.45 | 28.45,19.3 v28.45,18.8 41.06,18.8 R6.2
  Top 0.406: 86.77,49.58 89.03,49.58 91.53,52.08 91.53,55.08 90.28,56.33 87.27,56.33 85.65,57.95 R32.2 85.65,71.88 82.04,71.88 82.04,73.52 C13.1 80.83,73.89 C18.1 77.76,71.22 | 86.77,49.58 85.03,49.58 | 85.03,49.56 U1_TQFP.18 | 86.77,49.58 86.77,47.08 88.39,45.47 89.15,45.47 91.19,43.43 ISP.2 | U$1.PIN4 21.16,18.8 v28.45,18.8 | 28.45,19.3 v58.42,49.28 v58.42,41.66 58.42,35.31 65.28,28.45 | 3.3V_REG.2 77.76,71.22 | 77.76,71.22 77.76,69.12 75.18,66.55 75.18,61.72 73.15,59.69 v68.33,59.69 | 65.28,28.45 v69.34,28.45 C2.1 R24.2 80.3,18.29 86.87,18.29 86.93,18.22 RF.VDD | 65.28,28.45 65.28,28.13 C22.2 62.94,23.86 ESP-12.16
  Bottom 0.203: 91.82,43.37 ISP.2
  Bottom 0.254: v61.72,41.66 v58.42,41.66
  Bottom 0.406: v58.42,49.28 v68.33,59.69
4.7V  (via drill 0.5, 1.1)
  Top 0.406: D1.C 73.96,63.85 | v72.39,74.68 72.39,71.06 C1.1 72.52,71.22 73.78,71.22 | D1.C 73.78,62.48 68.07,62.48 | 68.07,62.48 54.36,62.48 48.01,56.13 v41.15,56.13 | 68.07,62.48 v65.28,59.69 | v57.91,50.8 58.67,50.8 60.71,48.77 60.71,34.8 63.25,32.26 82.04,32.26 83.82,34.04 87.53,34.04 FTDI/UART.VCC | v48.26,46.74 39.37,37.85 v39.37,37.59 39.37,36.06 C9.1 34.47,34.08 SHUNTMON-B.2 | 42.42,48.17 v42.42,48.26 42.33,48.17 C26.1 38.14,48.01 v34.54,48.01 34.47,48.08 SHUNTMON-A.2 | D1.C 73.78,71.22 | 73.78,71.22 3.3V_REG.3
  Bottom 0.406: v41.15,56.13 41.15,54.61 v34.54,48.01 | v65.28,59.69 57.91,52.32 v57.91,50.8 | v48.26,46.74 43.94,46.74 v42.42,48.26
5.0V  (via drill 1.1)
  Top 0.61: D1.A 55.76,63.85 I1.P$2
  Top 1.016: 5V_REG.4 49.14,71.44 | 49.14,71.44 C48.1 | 55.76,71.44 I1.P$2 55.5,68.17 C3.1 | 55.76,71.44 49.14,71.44 | v58.42,74.68 58.42,71.44 55.76,71.44
ADC2
  Top 0.254: U1_TQFP.25 76.22,54.86 ANA.1
ADC3
  Top 0.254: U1_TQFP.26 76.61,53.34 70.87,53.34 69.42,54.79 ANA.2
ADCSHUNT-A
  Top 0.254: R13.2 51.82,54.86 55.48,58.53 R16.2
ADCSHUNT-B
  Top 0.254: R5.2 56.32,57.69 R4.2
ADCVSENSE-A  (via drill 0.5)
  Top 0.254: R15.2 R14.1 28.96,44.96 v32.77,44.96 | v49.53,44.96 56.9,52.32 75.37,52.32 U1_TQFP.28
  Bottom 0.254: v32.77,44.96 v49.53,44.96
ADCVSENSE-B  (via drill 0.5)
  Top 0.254: R2.2 R1.1 28.96,31.5 37.34,31.5 57.4,51.56 68.07,51.56 68.4,51.89 71.2,51.89 v71.5,51.59 | v76.45,52.32 76.5,52.32 U1_TQFP.27
  Bottom 0.254: v71.5,51.59 75.72,51.59 v76.45,52.32
CH_PD
  Top 0.254: ESP-12.11 61.98,12.7 R7.1
D0/RX  (via drill 0.5)
  Top 0.254: v47.5,36.32 v54.86,43.69 | v68.58,50.29 75.18,50.29 76,49.48 U1_TQFP.30
  Bottom 0.254: RX.2 32,14.48 32,20.83 v47.5,36.32 | v54.86,43.69 61.47,50.29 v68.58,50.29 70.87,48.01 72.9,48.01 82.55,38.35 87.58,38.35 FTDI/UART.TXO
D1/TX  (via drill 0.5)
  Top 0.254: v47.5,34.8 v56.39,43.69 | v67.56,49.53 v71.88,49.53 74.68,49.53 75.34,48.87 U1_TQFP.31
  Bottom 0.254: TX.2 34.29,21.59 v47.5,34.8 | v56.39,43.69 62.23,49.53 v67.56,49.53 | FTDI/UART.RXI 90.12,38.86 83.31,38.86 72.64,49.53 v71.88,49.53
D2  (via drill 0.5)
  Top 0.254: RF.IRQ 94.93,28.45 v95,28.45 | v72.49,47.14 73.7,48.3 U1_TQFP.32
  Bottom 0.254: v95,28.45 95,33.53 81.03,33.53 81.03,38.61 v72.49,47.14
D3
  Top 0.254: U1_TQFP.1 70.1,46.19 I/O.1
D4
  Top 0.203: U1_TQFP.2 75.43,45.66 75.44,45.67
  Top 0.254: U1_TQFP.2 74.52,44.7 70.87,44.7 I/O.2
D5/PWM0  (via drill 0.5)
  Top 0.203: 80.81,42.38 U1_TQFP.9
  Top 0.254: 80.81,42.38 v78.42,40.03 | v39.37,43.43 37.34,45.47 R8.2
  Bottom 0.254: v78.42,40.03 42.67,40.13 v39.37,43.43
D6
  Top 0.254: U1_TQFP.10 82.67,41.63 R10.2
D7
  Top 0.203: U1_TQFP.11 82.07,43.41 82.02,43.41
D8  (via drill 0.5)
  Top 0.203: U1_TQFP.12 82.63,43.98 82.6,43.97
  Top 0.254: S3.4 v89.66,51.82 | U1_TQFP.12 82.63,43.88 v83.59,42.93
  Bottom 0.254: v89.66,51.82 89.66,45.47 86.11,41.91 84.61,41.91 v83.59,42.93
D9  (via drill 0.5)
  Top 0.203: U1_TQFP.13 83.2,44.56 83.18,44.48
  Top 0.254: S3.3 86.72,54.38 v88.7,54.38 | U1_TQFP.13 84.72,42.98 v85.72,42.98
  Bottom 0.254: v85.72,42.98 88.7,45.95 v88.7,54.38
D10  (via drill 0.5)
  Top 0.203: U1_TQFP.14 83.72,45.06 83.74,45.16
  Top 0.254: R24.1 82.04,19.94 | 82.04,19.94 96.93,19.91 RF.SEL | U1_TQFP.14 84.78,44.04 v84.78,44.02 | v91.69,39.12 79.76,39.12 v79.5,38.86 | v79.5,31.24 82.04,28.7 82.04,19.94
  Bottom 0.254: v84.78,44.02 84.71,43.94 83.06,43.94 82.55,43.43 82.55,42.16 83.82,40.89 88.14,40.89 89.41,39.62 91.19,39.62 v91.69,39.12 | v79.5,38.86 v79.5,31.24
D11/MOSI  (via drill 0.5)
  Top 0.203: U1_TQFP.15 84.3,45.62 84.28,45.7
  Top 0.254: ISP.4 91.76,44.22 95.76,44.22 95.76,40.64 94.74,40.64 | U1_TQFP.15 84.42,45.62 89.41,40.64 94.74,40.64 | RF.SDI 92.96,14.89 v92.96,18.8 | v96.27,33.53 96.77,34.04 96.77,36.83 94.74,38.86 94.74,40.64
  Bottom 0.254: v92.96,18.8 96.27,22.1 v96.27,33.53
D12/MISO  (via drill 0.5)
  Top 0.203: 84.85,46.26 U1_TQFP.16
  Top 0.254: U1_TQFP.16 89.68,41.4 94.31,41.4 94.3,43.24 ISP.1 | RF.SDO 98.3,32.23 98.3,38.86 v97.03,40.13
  Bottom 0.254: v97.03,40.13 94.3,42.86 ISP.1
D13/SCK  (via drill 0.5)
  Top 0.203: v85.7,47.51 84.92,48.3 U1_TQFP.17 84.85,48.2 | v87.89,47.51 88,47.25 88.48,46.75 93.56,46.74 ISP.3
  Top 0.254: RF.SCK 94.93,18.73 v95,18.8 | ISP.3 96.27,45.47 v96.27,38.86 97.54,37.59 v97.54,33.53
  Bottom 0.203: v85.7,47.51 v87.89,47.51
  Bottom 0.254: v95,18.8 97.54,21.34 v97.54,33.53
DIG1
  Top 0.254: RF.ANT 84.91,14.86
  Top 0.406: RF.ANT | C20/TUNE.1 82.65,12.15 C19.1
  Top 1.016: C19.1 RF.ANT
ESPRX
  Top 0.254: ESP-12.7 42.79,10.89 R17.2 R18.1 42.76,14.73 TX.1
ESPTX  (via drill 0.5)
  Top 0.254: RX.1 36.83,8.89 ESP-12.8 v48.77,8.89
  Bottom 0.254: v48.77,8.89 55.12,8.89 55.12,22.35 57.66,22.35 FTDI1.2
GND  (via drill 0.5, 3.2 pad 5.59)  (1 unrouted)
  Top 0.254: S3.1 S3.2
  other vias: 10.08,67.21 71.78,42.59 69.71,33.79 92.07,67.23 51.89,75.03 90.41,58.75 10.08,9.2 92.07,9.2 33.51,32.85 15.17,56.58 30.44,42.29 37.04,49.01 84.43,57.03 80.87,56.21 5.76,19.36 70.94,68.18 30.66,48.96 32.13,58.33 37.39,37.35 28.05,9.66 47.86,22.62 80.62,25.78 86.46,27.56 79.91,47.25 82.91,14.49 87.49,12.2 82.53,9.54 88.76,17.54 85.2,17.28 51.42,13.22 23.22,12.2 15.86,9.66 53.96,35.06 53.96,46.49 55.23,53.86 55.99,60.46 44.56,59.19 45.32,60.46 76.81,55.4 67.59,69.65 47.7,69.7 29.18,70.67 16.1,70.44 16.08,67.24 21.13,45.01 16.84,44.99 30.48,29.4 37.54,43.19 36.04,69.9 87.23,9.66 87.23,7.12 82.41,6.87 81.86,69.95 85.67,74.27
  pour Bottom (isolate 0.254): 6.86,76.2 6.86,63.5 0.25,63.5 0.25,12.95 6.86,12.95 6.86,2.54 95.76,2.54 95.76,12.95 98.81,12.95 98.81,63.5 95.76,63.5 95.76,76.2
  pour Top (isolate 0.254): 6.86,76.2 6.86,63.5 0.25,63.5 0.25,12.95 6.86,12.95 6.86,2.54 95.76,2.54 95.76,12.95 98.81,12.95 98.81,63.5 95.76,63.5 95.76,76.2
GPIO0  (via drill 0.5)
  Top 0.254: GPIO0.2 45.21,24.89 48.77,24.89 v51.31,22.35 | v51.31,19.3 48.9,16.89 ESP-12.4
  Bottom 0.254: v51.31,22.35 v51.31,19.3
GPIO2  (via drill 0.5)
  Top 0.254: U$1.PIN2 18.96,3.05 42.67,3.05 v42.67,4.83 | v42.67,16.26 42.67,18.87 | R6.1 42.78,18.89 ESP-12.3
  Top 0.406: 42.67,18.87 R6.1
  Bottom 0.254: v42.67,4.83 v42.67,16.26
GPIO4
  Top 0.254: ESP-12.6 49.78,12.89 49.78,7.87 36.07,7.87 36.07,10.92 31.39,10.92 GPIO-4/5.1
GPIO5
  Top 0.254: ESP-12.5 50.29,14.89 50.29,7.37 35.31,7.37 35.31,8.38 31.39,8.38 GPIO-4/5.2
GPIO12
  Top 0.254: U$1.PIN7 24.46,6.6 58.17,6.6 58.17,18.89 ESP-12.14
GPIO13  (via drill 0.5)
  Top 0.254: U$1.PIN3 20.06,5.08 v25.65,5.08 | v56.39,20.83 61.98,20.83
  Top 0.406: 61.98,20.83 ESP-12.15
  Bottom 0.254: v56.39,20.83 56.39,3.81 41.91,3.81 40.89,4.83 25.65,4.83 v25.65,5.08
GPIO14
  Top 0.254: U$1.PIN5 22.26,6.1 59.44,6.1 59.44,16.89 ESP-12.13
GPIO15  (1 unrouted)
  Top 0.254: 44.14,20.89 ESP-12.2 | R3.2 43.43,20.89 ESP-12.2 | C22.1 61.47,27.5 61.47,24.64 59.69,22.86 53.85,22.86 51.88,20.89 ESP-12.2 | ESP-12.1 46.06,22.61 47.75,22.61
GPIO16
  Top 0.254: ESP-12.12 MC1.P$1 MC1.P$2
IND
  Top 1.016: 5V_REG.2 49.63,68.04 | 49.63,68.04 I1.P$1 | 49.63,68.04 49.63,65.1 D2.P$1
INPUT-POS-A
  Top 0.254: R14.2 28.96,50.04
  Top 0.406: T1.2 9.46,50.07 C30.1 9.82,50.04 J2.1 J2.2 J2.3 28.96,50.04 33.69,50.04 33.82,49.91 SHUNTMON-A.1 33.02,48.86 C25.1
INPUT-POS-B  (1 unrouted)
  Top 0.254: R1.2 28.96,36.07
  Top 0.406: T2.2 9.65,36.1 | 9.65,36.07 C29.1 9.65,36.1 | J3.1 J3.2 J3.3 23.88,36.07 28.96,36.07 33.82,36.07 SHUNTMON-B.1 32.84,34.71 C6.1 | 12.19,36.1 9.65,36.1
LOAD-NEG-A
  Top 0.406: T1.1 9.46,53.57 C31.1 9.82,53.59 J1.1 J1.2 J1.3 33.82,53.59 SHUNTMON-A.8 33.02,54.78 C23.2
  Top 1.016: JP3.2 9.43,58.42 T1.1
LOAD-NEG-B  (1 unrouted)
  Top 0.254: J4.1 10.19,39.62 arc90 10.16,39.6
  Top 0.406: T2.1 10.16,39.6 12.19,39.6 | 9.65,39.62 C28.1 | J4.1 J4.2 J4.3 33.82,39.62 SHUNTMON-B.8 32.64,41.19 C24.2
  Top 1.016: T2.1 4.57,44.96 C-TANT.1
N$1
  Top 0.203: 78.23,42.77 U1_TQFP.7
  Top 0.254: C4.1 63.65,38.1 Q1.2 65.28,38.1 66.55,39.62 75.09,39.62 78.23,42.77
  Top 0.406: Q1.2
N$2
  Top 0.203: U1_TQFP.23 81.5,51.66 81.48,51.66
  Top 0.254: R4.1 C5.2 82.04,54.84 82.04,52.23 U1_TQFP.23
N$3
  Top 1.016: C19.2 ANT1.1
N$4
  Top 0.254: SHUNTMON-A.5 35.77,54.86 R13.1
N$6
  Top 0.254: SHUNTMON-B.5 35.81,40.81 R5.1
N$9
  Top 0.203: 78.9,42.28 U1_TQFP.8
  Top 0.254: 74.64,37.88 75.55,37.88 | 75.55,37.88 C11.1 | U1_TQFP.8 75.55,38.95 75.55,37.88
  Top 0.406: 74.64,37.88 Q1.1
N$20
  Top 0.203: U1_TQFP.20 83.14,50 83.16,49.94
  Top 0.254: U1_TQFP.20 84.42,51.22 C8.1
N$27
  Top 0.254: U1_TQFP.24 79.76,53.44 C27.2 77.19,56.15 R16.1
N$28  (via drill 0.5)
  Top 0.254: v35.05,57.15 35.05,53.97 SHUNTMON-A.6 SHUNTMON-A.7
  Bottom 0.254: v35.05,57.15 44.48,57.15 REFERENCE_SELECT.2
N$30  (via drill 0.5)
  Top 0.254: v66.04,6.6 66.04,8.89 C21.2
  Bottom 0.254: FTDI1.1 60.2,6.6 v66.04,6.6
N$31
  Top 0.254: 94.74,1.02 7.62,1.02 7.62,1.52 84.91,1.52 84.91,5.33
N$36  (via drill 0.5)
  Top 0.254: v39.37,11.94 39.37,10.92 R17.1
  Bottom 0.254: FTDI1.3 55.12,23.62 39.37,23.62 v39.37,11.94
N$41
  Top 0.254: R10.1 84.42,40.11 LED1.A
POWERIN  (1 unrouted)
  Top 1.016: 44.27,66.33 5V_REG.1 43.5,66.33 C51.1 27.69,62.66 | 27.69,62.66 27.56,62.66 27.56,68.96 | JP3.1 24.64,59.62 27.69,62.66
REFINPUT  (via drill 0.5)
  Top 0.254: SHUNTMON-B.6 SHUNTMON-B.7 34.46,40 C12.1 R8.1 34.46,46.99 v40.64,46.99
  Bottom 0.254: v40.64,46.99 40.64,50.67 REFERENCE_SELECT.1
RES  (via drill 0.5)
  Top 0.254: v86.87,61.98 86.93,62.04 89.98,62.04 91.31,63.37 | 72.71,51.31 C17.1 72.71,51.05 72.14,51.05 71.83,50.75 70.33,50.75 v70.05,51.03 | MC32882.P$1 MC32882.P$2 89.21,65.47 91.31,63.37 | 91.31,63.37 92.71,61.98 96.52,61.98 v98.04,60.45
  Bottom 0.254: v70.05,51.03 70.08,52.83 73.15,52.83 82.3,61.98 v86.87,61.98 | FTDI/UART.DTR 98.04,37.19 v98.04,60.45
RESET  (via drill 0.5)
  Top 0.254: C17.2 75.13,51.44 U1_TQFP.29 77.22,49.34 v77.67,48.92 | R32.1 v88.89,63.49 v88.9,63.5
  Bottom 0.254: ISP.5 94.3,59.63 92.71,61.21 89.15,61.21 | v77.67,48.92 77.72,49.02 77.72,55.88 83.06,61.21 89.15,61.21 | v88.9,63.5 88.9,61.47 89.15,61.21
RESTESP
  Top 0.254: ESP-12.9 C21.1 64.43,10.83 R19.1

### Text on the board
tPlace: GND | RST | VSENSE-B | D3 | D11 | D13 | D4 | 3.3V | D12 | VSENSE-A
bPlace: emonDC | wireless energy monitoring node | Technology that helps us live within ecological limits | Designed in | Designed in North Wales UK by Megni | North Wales | Made in UK | Node: | OpenEnergyMonitor.org | Open-Hardware | Lead free PCB - RoHS components
tNames: I1 | RESET | D2 | ADC3 | ADC2 | 16MHz | ESP / FACTORY / RESET | GND / (0V) | MICRO SD | GPIO4 | GPIO5
tValues: B | A
tSilk: 5.0V | 4.7V | D9 | 2 / / 1 | D8 | GND | 5V | Tx | Rx | RST | UART / FTDI | GND | 5V | Tx | Rx | RST | emonDC | Wireless Energy / Monitoring Node | v0.4 Jan 2017 by DB | based on emonTx / v3.4 by GH and TL
_tsilk: Designed in | North Wales | Made in UK
_bsilk: SMT V0.6 rev3 | emonTx | wireless energy monitoring node | SMT V0.6 rev3 | emonTx | SMT V0.6 rev3 | emonTx | Technology that helps us live within ecological limits | wireless energy monitoring node | wireless energy monitoring node | Designed in North Wales UK by Glyn Hudson & Trystan Lea | Technology that helps us live within ecological limits | Technology that helps us live within ecological limits | Designed in North Wales UK by Glyn Hudson & Trystan Lea | 165mm ant | 433Mhz | Designed in North Wales UK by Glyn Hudson & Trystan Lea | 165mm ant | 165mm ant | 433Mhz | 433Mhz | 868Mhz | 82mm ant | 82mm ant | 82mm ant | 868Mhz | 868Mhz | 78mm ant | 915Mhz | 78mm ant | 915Mhz | 78mm ant | 915Mhz | 165mm ant | 433Mhz | 82mm ant | 868Mhz | 78mm ant | 915Mhz